# Altium project BAI3.PrjPcb
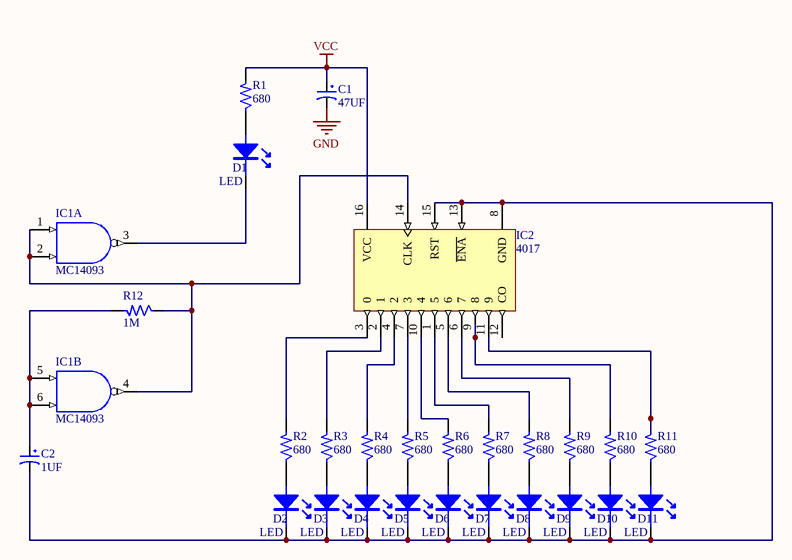
[diagram p0: BAI3.SchDoc]
1 sheet, 27 parts. Net scope: global (net labels, ports and power ports of the same name join across sheets).

## Sheet BAI3.SchDoc
size A; SheetNumber: 1; SheetTotal: 1

### Parts
C1  47UF  [CP1/2]
C2  1UF  [CP1/2]
D1  LED  [CAP10UF]
D2  LED  [CAP10UF]
D3  LED  [CAP10UF]
D4  LED  [CAP10UF]
D5  LED  [CAP10UF]
D6  LED  [CAP10UF]
D7  LED  [CAP10UF]
D8  LED  [CAP10UF]
D9  LED  [CAP10UF]
D10  LED  [CAP10UF]
D11  LED  [CAP10UF]
IC1  MC14093  [DIP14]  (parts A,B of 4)
IC2  4017  [DIP16]
R1  680  [R1/6W]
R2  680  [R1/6W]
R3  680  [R1/6W]
R4  680  [R1/6W]
R5  680  [R1/6W]
R6  680  [R1/6W]
R7  680  [R1/6W]
R8  680  [R1/6W]
R9  680  [R1/6W]
R10  680  [R1/6W]
R11  680  [R1/6W]
R12  1M  [R1/6W]

### Nets
GND: C1.2 IC1.7(GND)
VCC: C1.1 IC2.16(VCC) R1.2
VDD: IC1.14(VDD)
NetC2_1: C2.1 IC1.5(A) IC1.6(B) R12.2
NetC2_2: C2.2 D2.2 D3.2 D4.2 D5.2 D6.2 D7.2 D8.2 D9.2 D10.2 D11.2 IC2.8(GND) IC2.13(~{ENA}) IC2.15(RST)
NetD1_1: D1.1 R1.1
NetD1_2: D1.2 IC1.3(~{Y})
NetD2_1: D2.1 R2.1
NetD3_1: D3.1 R3.1
NetD4_1: D4.1 R4.1
NetD5_1: D5.1 R5.1
NetD6_1: D6.1 R6.1
NetD7_1: D7.1 R7.1
NetD8_1: D8.1 R8.1
NetD9_1: D9.1 R9.1
NetD10_1: D10.1 R10.1
NetD11_1: D11.1 R11.1
NetIC1_1: IC1.1(A) IC1.2(B) IC1.4(~{Y}) IC2.14(CLK) R12.1
NetIC2_1: IC2.1(5) R7.2
NetIC2_2: IC2.2(1) R3.2
NetIC2_3: IC2.3(0) R2.2
NetIC2_4: IC2.4(2) R4.2
NetIC2_5: IC2.5(6) R8.2
NetIC2_6: IC2.6(7) R9.2
NetIC2_7: IC2.7(3) R5.2
NetIC2_9: IC2.9(8) R10.2
NetIC2_10: IC2.10(4) R6.2
NetIC2_11: IC2.11(9) R11.2

Not connected (* = marked no-connect by the designer): IC2 12(CO)

### Library data of the parts
C1 C2 = CP1: Cap P  0,1uF < 22uF , 16 - 50V; Value: 10uF/50V; Description 1: 10 => 220uF/6,3V/10V - 10uF => 100uF/16V; Description 2: 0,1uF => 33uF/50V - 10uF => 22uF/63V; Description 3: 0,47uF => 10uF/100V
IC1 = MC14093: Quad 2-Input NAND Schmitt Trigger; Value: MC14093
IC2 = 4017: Decade Counter/Divider with 10 Decoded Outputs; Designed by: VanDungEvn; Value: CD4017
R1-R12 = Res: Resistor 1/4W; Value: R1/4W - 1K